# EAGLE schematic vl100-discovery (EAGLE 5.12)
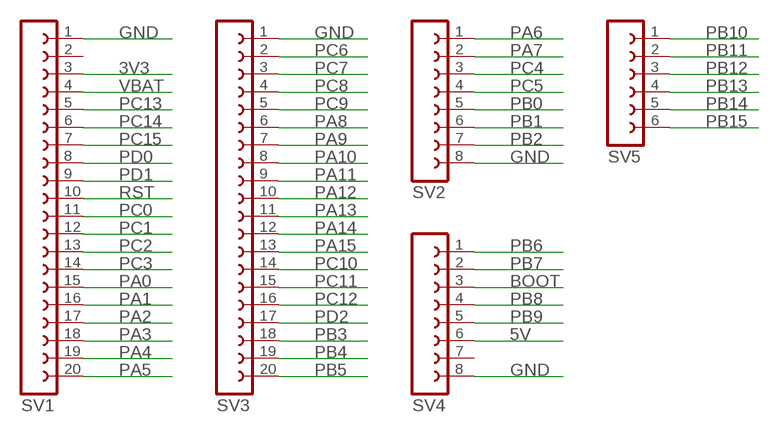
[diagram p0: schematic, sheet 1]

## Parts
SV1  FE20-1  [FE20]
SV2  FE08-1  [FE08]
SV3  FE20-1  [FE20]
SV4  FE08-1  [FE08]
SV5  FE06-1  [FE06]

## Nets
3V3: SV1.3
5V: SV4.6
BOOT: SV4.3
GND: SV1.1 SV2.8 SV3.1 SV4.8
PA0: SV1.15
PA1: SV1.16
PA2: SV1.17
PA3: SV1.18
PA4: SV1.19
PA5: SV1.20
PA6: SV2.1
PA7: SV2.2
PA8: SV3.6
PA9: SV3.7
PA10: SV3.8
PA11: SV3.9
PA12: SV3.10
PA13: SV3.11
PA14: SV3.12
PA15: SV3.13
PB0: SV2.5
PB1: SV2.6
PB2: SV2.7
PB3: SV3.18
PB4: SV3.19
PB5: SV3.20
PB6: SV4.1
PB7: SV4.2
PB8: SV4.4
PB9: SV4.5
PB10: SV5.1
PB11: SV5.2
PB12: SV5.3
PB13: SV5.4
PB14: SV5.5
PB15: SV5.6
PC0: SV1.11
PC1: SV1.12
PC2: SV1.13
PC3: SV1.14
PC4: SV2.3
PC5: SV2.4
PC6: SV3.2
PC7: SV3.3
PC8: SV3.4
PC9: SV3.5
PC10: SV3.14
PC11: SV3.15
PC12: SV3.16
PC13: SV1.5
PC14: SV1.6
PC15: SV1.7
PD0: SV1.8
PD1: SV1.9
PD2: SV3.17
RST: SV1.10
VBAT: SV1.4
Unconnected: SV1.2 SV4.7

## Library data of the parts
SV1 SV3 = con-lsta:FE20-1: FEMALE HEADER; OC_FARNELL: unknown; OC_NEWARK: unknown
SV2 SV4 = con-lsta:FE08-1: FEMALE HEADER; OC_FARNELL: unknown; OC_NEWARK: unknown
SV5 = con-lsta:FE06-1: FEMALE HEADER; OC_FARNELL: unknown; OC_NEWARK: unknown